# EAGLE design Dashboard Tester rev1 (EAGLE 9.6.2)
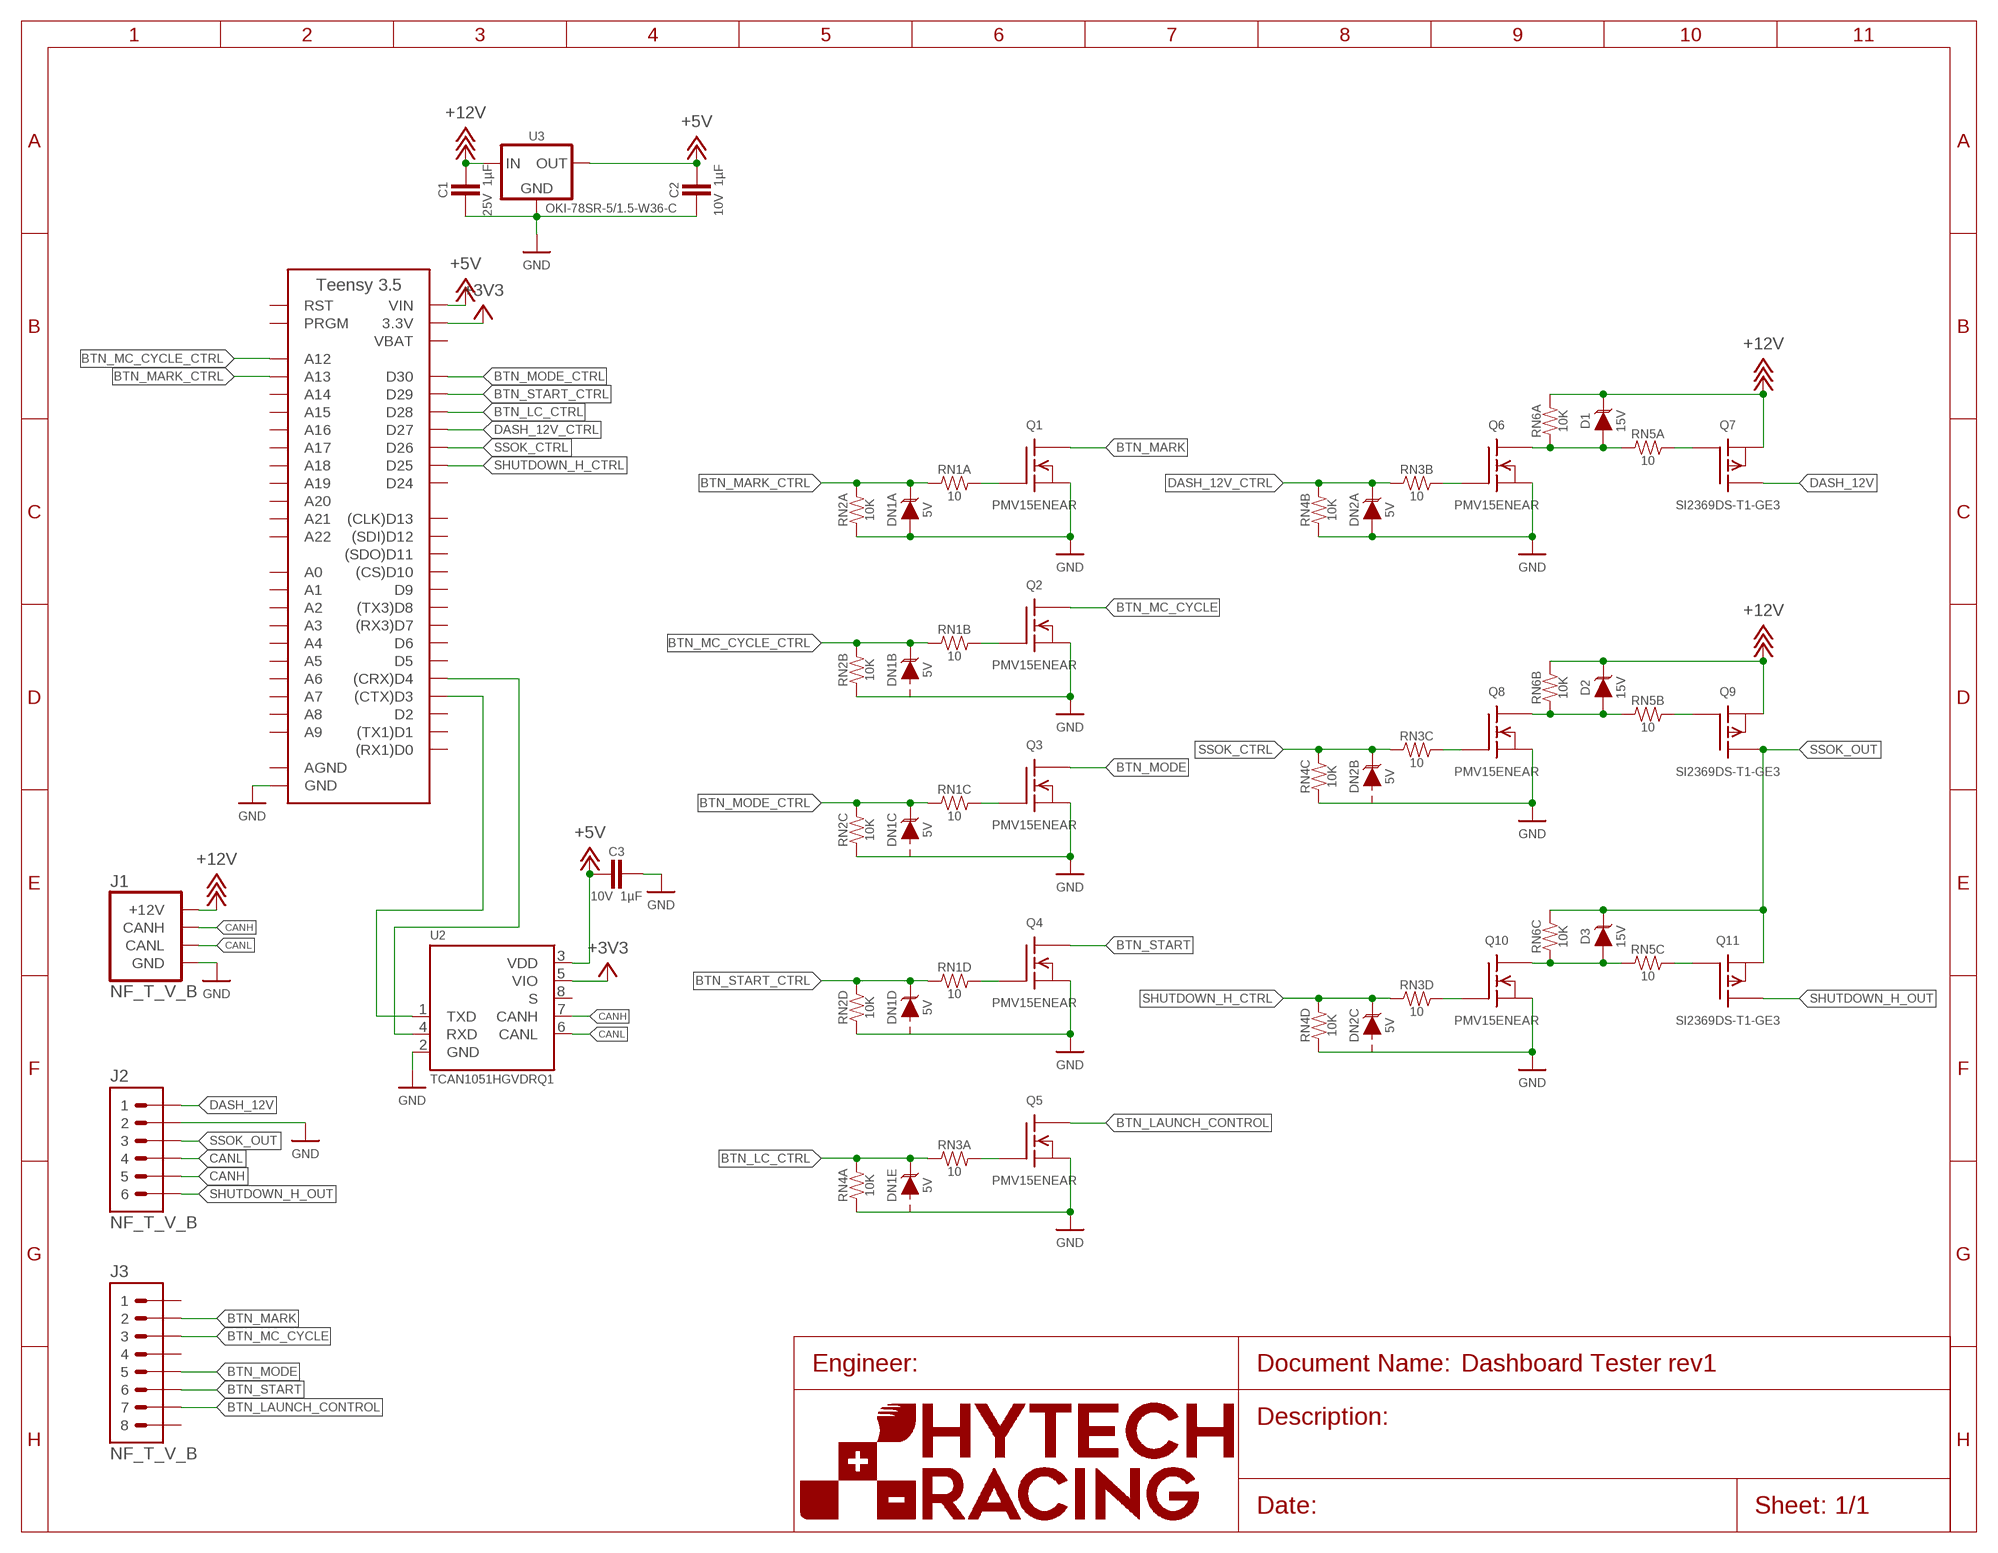
[diagram p0: schematic, sheet 1]
U$1 (FRAME_A): FRAME_DESCRIPTION: Default; ORIENTATION: LANDSCAPE; SIZE: A

## Parts
C1  CAPACITOR_0603_25V_1UF  [0603-CAP]
C2  CAPACITOR_0603_10V_1UF  [0603-CAP]
C3  CAPACITOR_0603_10V_1UF  [0603-CAP]
D1  TVS_15V  [SOT-23]
D2  TVS_15V  [SOT-23]
D3  TVS_15V  [SOT-23]
DN1  TVS_ARRAY_5V  [SOT363]
DN2  TVS_ARRAY_5V  [SOT363]
J1  CONNECTOR-CAN_NF_T_V_BLACK  [MOLEX_NANOFIT_PTH_04]
J2  CONNECTOR-6_NF_T_V_BLACK  [MOLEX_NANOFIT_PTH_06]
J3  CONNECTOR-8_NF_T_V_BLACK  [MOLEX_NANOFIT_PTH_08]
Q1  TRANSISTOR_N_MOS_PMV15ENEA  [SOT-23]
Q2  TRANSISTOR_N_MOS_PMV15ENEA  [SOT-23]
Q3  TRANSISTOR_N_MOS_PMV15ENEA  [SOT-23]
Q4  TRANSISTOR_N_MOS_PMV15ENEA  [SOT-23]
Q5  TRANSISTOR_N_MOS_PMV15ENEA  [SOT-23]
Q6  TRANSISTOR_N_MOS_PMV15ENEA  [SOT-23]
Q7  TRANSISTOR_P_MOS_SOT23_SI2369DS-T1-GE3  [SOT-23]
Q8  TRANSISTOR_N_MOS_PMV15ENEA  [SOT-23]
Q9  TRANSISTOR_P_MOS_SOT23_SI2369DS-T1-GE3  [SOT-23]
Q10  TRANSISTOR_N_MOS_PMV15ENEA  [SOT-23]
Q11  TRANSISTOR_P_MOS_SOT23_SI2369DS-T1-GE3  [SOT-23]
RN1  RESISTOR_NETWORK_4_10  [1206-RES]
RN2  RESISTOR_NETWORK_4_10K  [1206-RES]
RN3  RESISTOR_NETWORK_4_10  [1206-RES]
RN4  RESISTOR_NETWORK_4_10K  [1206-RES]
RN5  RESISTOR_NETWORK_4_10  [1206-RES]
RN6  RESISTOR_NETWORK_4_10K  [1206-RES]
U1  TEENSY_3.5  [TEENSY_LONG_EXT]
U2  CAN_TRANSCIEVER_TCAN1051HQV-Q1  [SOIC-08]
U3  VOLTAGE_REGULATOR_OKI-78SR_5V  [OKI-78SR]

## Nets
+3V3: U1.3V3(3.3V) U1.3V3@2(3.3V) U1.3V3@3(3.3V) U2.5(VIO)
+5V: C2.1 C3.2 U1.VIN U2.3(VDD) U3.3(OUT)
+12V: C1.1 D1.3(C) D2.3(C) J1.1(+12V) Q7.2(S) Q9.2(S) RN6.7 RN6.8 U3.1(IN)
BTN_LAUNCH_CONTROL: J3.7 Q5.3(D)
BTN_LC_CTRL: DN1.6(E:C) RN3.1 RN4.8 U1.D28
BTN_MARK: J3.2 Q1.3(D)
BTN_MARK_CTRL: DN1.1(A:C) RN1.1 RN2.8 U1.D32(A13)
BTN_MC_CYCLE: J3.3 Q2.3(D)
BTN_MC_CYCLE_CTRL: DN1.3(B:C) RN1.2 RN2.7 U1.D31(A12)
BTN_MODE: J3.5 Q3.3(D)
BTN_MODE_CTRL: DN1.4(C:C) RN1.3 RN2.6 U1.D30
BTN_START: J3.6 Q4.3(D)
BTN_START_CTRL: DN1.5(D:C) RN1.4 RN2.5 U1.D29
CANH: J1.4(CANH) J2.5 U2.7(CANH)
CANL: J1.3(CANL) J2.4 U2.6(CANL)
DASH_12V: J2.1 Q7.3(D)
DASH_12V_CTRL: DN2.1(A:C) RN3.2 RN4.7 U1.D27
GND: C1.2 C2.2 C3.1 DN1.2(A:A) DN2.2(A:A) J1.2(GND) J2.2 Q1.2(S) Q2.2(S) Q3.2(S) Q4.2(S) Q5.2(S) Q6.2(S) Q8.2(S) Q10.2(S) RN2.1 RN2.2 RN2.3 RN2.4 RN4.1 RN4.2 RN4.3 RN4.4 U1.GND U1.GND@2(GND) U1.GND@3(GND) U2.2(GND) U3.2(GND)
N$1: Q1.1(G) RN1.8
N$2: U1.D4((CRX)D4) U2.4(RXD)
N$3: Q6.1(G) RN3.7
N$4: Q2.1(G) RN1.7
N$6: Q3.1(G) RN1.6
N$8: Q4.1(G) RN1.5
N$10: Q5.1(G) RN3.8
N$13: Q8.1(G) RN3.6
N$15: Q9.1(G) RN5.7
N$16: D2.1(A) Q8.3(D) RN5.2 RN6.2
N$17: Q7.1(G) RN5.8
N$18: Q10.1(G) RN3.5
N$19: D1.1(A) Q6.3(D) RN5.1 RN6.1
N$20: U1.D3((CTX)D3) U2.1(TXD)
N$21: Q11.1(G) RN5.6
N$22: D3.1(A) Q10.3(D) RN5.3 RN6.3
SHUTDOWN_H_CTRL: DN2.4(C:C) RN3.4 RN4.5 U1.D25
SHUTDOWN_H_OUT: J2.6 Q11.3(D)
SSOK_CTRL: DN2.3(B:C) RN3.3 RN4.6 U1.D26
SSOK_OUT: D3.3(C) J2.3 Q9.3(D) Q11.2(S) RN6.6
Unconnected: DN2.5(D:C) DN2.6(E:C) J3.1 J3.4 J3.8 RN5.4 RN5.5 RN6.4 RN6.5 U1.D0((RX1)D0) U1.D1((TX1)D1) U1.D2 U1.D5 U1.D6 U1.D7((RX3)D7) U1.D8((TX3)D8) U1.D9 U1.D10((CS)D10) U1.D11((SDO)D11) U1.D12((SDI)D12) U1.D13((CLK)D13) U1.D14(A0) U1.D15(A1) U1.D16(A2) U1.D17(A3) U1.D18(A4) U1.D19(A5) U1.D20(A6) U1.D21(A7) U1.D22(A8) U1.D23(A9) U1.D24 U1.D33(A14) U1.D34(A15) U1.D35(A16) U1.D36(A17) U1.D37(A18) U1.D38(A19) U1.D39(A20) U1.D40(A21) U1.D41(A22) U1.ON/OFF(RST) U1.PRGM U2.8(S)

## Power pins joined to a net without a drawn wire
AGND: U1.AGND/GND(AGND)
VBAT: U1.VBAT

## Library data of the parts
C1 = HyTechDevices:CAPACITOR_?_*: Capacitor, Non-Polarized VJ...1BC Series Datasheet <https://www.mouser.com/datasheet/2/427/vjw1bcbascomseries-1762447.pdf> Samsung Datasheet <https://www.mouser.com/datasheet/2/585/MLCC-1837944.pdf> Walsin Datasheet <https://www.mouser.com/datasheet/2/210/WTC_MLCC_General_Purpose-1534899.pdf>; CAPACITANCE: 1µF; DKPN: 1276-1184-1-ND; MANUFACTURER: Samsung Electro-Mechanics; MOPN: 187-CL10B105KA8NNNC; MPN: CL10B105KA8NNNC; TOLERANCE: 10%; VOLTAGE: 25V
C2 C3 = HyTechDevices:CAPACITOR_?_*: Capacitor, Non-Polarized VJ...1BC Series Datasheet <https://www.mouser.com/datasheet/2/427/vjw1bcbascomseries-1762447.pdf> Samsung Datasheet <https://www.mouser.com/datasheet/2/585/MLCC-1837944.pdf> Walsin Datasheet <https://www.mouser.com/datasheet/2/210/WTC_MLCC_General_Purpose-1534899.pdf>; CAPACITANCE: 1µF; DKPN: 311-1796-1-ND; MANUFACTURER: Yageo; MOPN: 603-CC603KRX7R6BB105; MPN: CC0603KRX7R6BB105; TOLERANCE: 10%; VOLTAGE: 10V
D1-D3 = HyTechDevices:TVS_*: TVS Diode GSOT Datasheet <https://www.mouser.com/datasheet/2/427/gsot03-1767593.pdf>; DKPN: GSOT15-E3-08CT-ND; MANUFACTURER: Vishay General Semiconductor - Diodes Division; MOPN: 78-GSOT15-E3-08; MPN: GSOT15-E3-08; VOLTAGE: 15V
DN1 DN2 = HyTechDevices:TVS_ARRAY_*: TVS Diode Array Datasheet <https://www.mouser.com/datasheet/2/427/vesd05a5-06gtovesd26a5-06g-1768003.pdf>; DKPN: 112-VESD05A5-06G-G3-08CT-ND; MANUFACTURER: Vishay General Semiconductor - Diodes Division; MOPN: 78-VESD05A5-06G-G308; MPN: VESD05A5-06G-G3-08; VOLTAGE: 5V
J1 = HyTechDevices:CONNECTOR-CAN_?_*: HyTech CAN Connector; MANUFACTURER: Molex; MODEL: NF_T_V_B; MPN: 105429-1304
J2 = HyTechDevices:CONNECTOR-6_?_*: 6 Pin Connector; MANUFACTURER: Molex; MODEL: NF_T_V_B; MPN: 105310-1306
J3 = HyTechDevices:CONNECTOR-8_?_*: 8 Pin Connector; MANUFACTURER: Molex; MODEL: NF_T_V_B; MPN: 105310-1308
Q1-Q6 Q8 Q10 = HyTechDevices:TRANSISTOR_N_MOS_*: N-MOSFET PMV15ENEA Datasheet <https://www.mouser.com/datasheet/2/916/PMV15ENEA-1604828.pdf>; DKPN: 1727-8588-1-ND; MANUFACTURER: Nexperia USA Inc.; MOPN: 771-PMV15ENEAR; MPN: PMV15ENEAR
Q7 Q9 Q11 = HyTechDevices:TRANSISTOR_P_MOS_?_*: MOSFET P Channel Datasheet <https://www.mouser.com/datasheet/2/427/si2369d-1764360.pdf>; DKPN: SI2369DS-T1-GE3CT-ND; MANUFACTURER: Vishay Siliconix; MOPN: 78-SI2369DS-T1-GE3; MPN: SI2369DS-T1-GE3
RN1 RN3 RN5 = HyTechDevices:RESISTOR_NETWORK_4_*: Resistor Network, 4 Elements YC/TC Series <https://www.mouser.com/datasheet/2/447/yageo_yago_s_a0009164376_1-1991537.pdf> CAT/CAY 16 Series <https://www.mouser.com/datasheet/2/54/CATCAY-777361.pdf>; DKPN: CAT16-100J4LFCT-ND; MANUFACTURER: Bourns Inc.; MOPN: 652-CAT16-100J4LF; MPN: CAT16-100J4LF; RESISTANCE: 10
RN2 RN4 RN6 = HyTechDevices:RESISTOR_NETWORK_4_*: Resistor Network, 4 Elements YC/TC Series <https://www.mouser.com/datasheet/2/447/yageo_yago_s_a0009164376_1-1991537.pdf> CAT/CAY 16 Series <https://www.mouser.com/datasheet/2/54/CATCAY-777361.pdf>; DKPN: YAG3410CT-ND; MANUFACTURER: Yageo; MOPN: 603-TC164-FR-0710KL; MPN: TC164-FR-0710KL; RESISTANCE: 10K
U1 = HyTechDevices:TEENSY_3.5; TEENSY: 3.5
U2 = HyTechDevices:CAN_TRANSCIEVER_TCAN1051*V-Q1: TCAN1051*V Can Tranciever Datasheet <https://www.ti.com/lit/ds/symlink/tcan1051hgv-q1.pdf?HQS=dis-mous-null-mousermode-dsf-pf-null-wwe&ts=1610765132518&ref_url=https%253A%252F%252Fwww.mouser.com%252Ff>; DKPN: 296-49935-1-ND; MANUFACTURER: Texas Instruments; MOPN: 595-TCAN1051HGVDQ1; MPN: TCAN1051HGVDRQ1
U3 = HyTechDevices:VOLTAGE_REGULATOR_?_*: Voltage Regulators LDL1117S50R Datasheet <https://www.mouser.com/datasheet/2/389/dm00366442-1799212.pdf> OKI-78SR Datasheet <https://www.mouser.com/datasheet/2/281/oki-78sr-56393.pdf>; DKPN: 811-2196-5-ND; MANUFACTURER: Murata Power Solutions Inc.; MOPN: 580-OKI78SR5/1.5W36C; MPN: OKI-78SR-5/1.5-W36-C

## Board
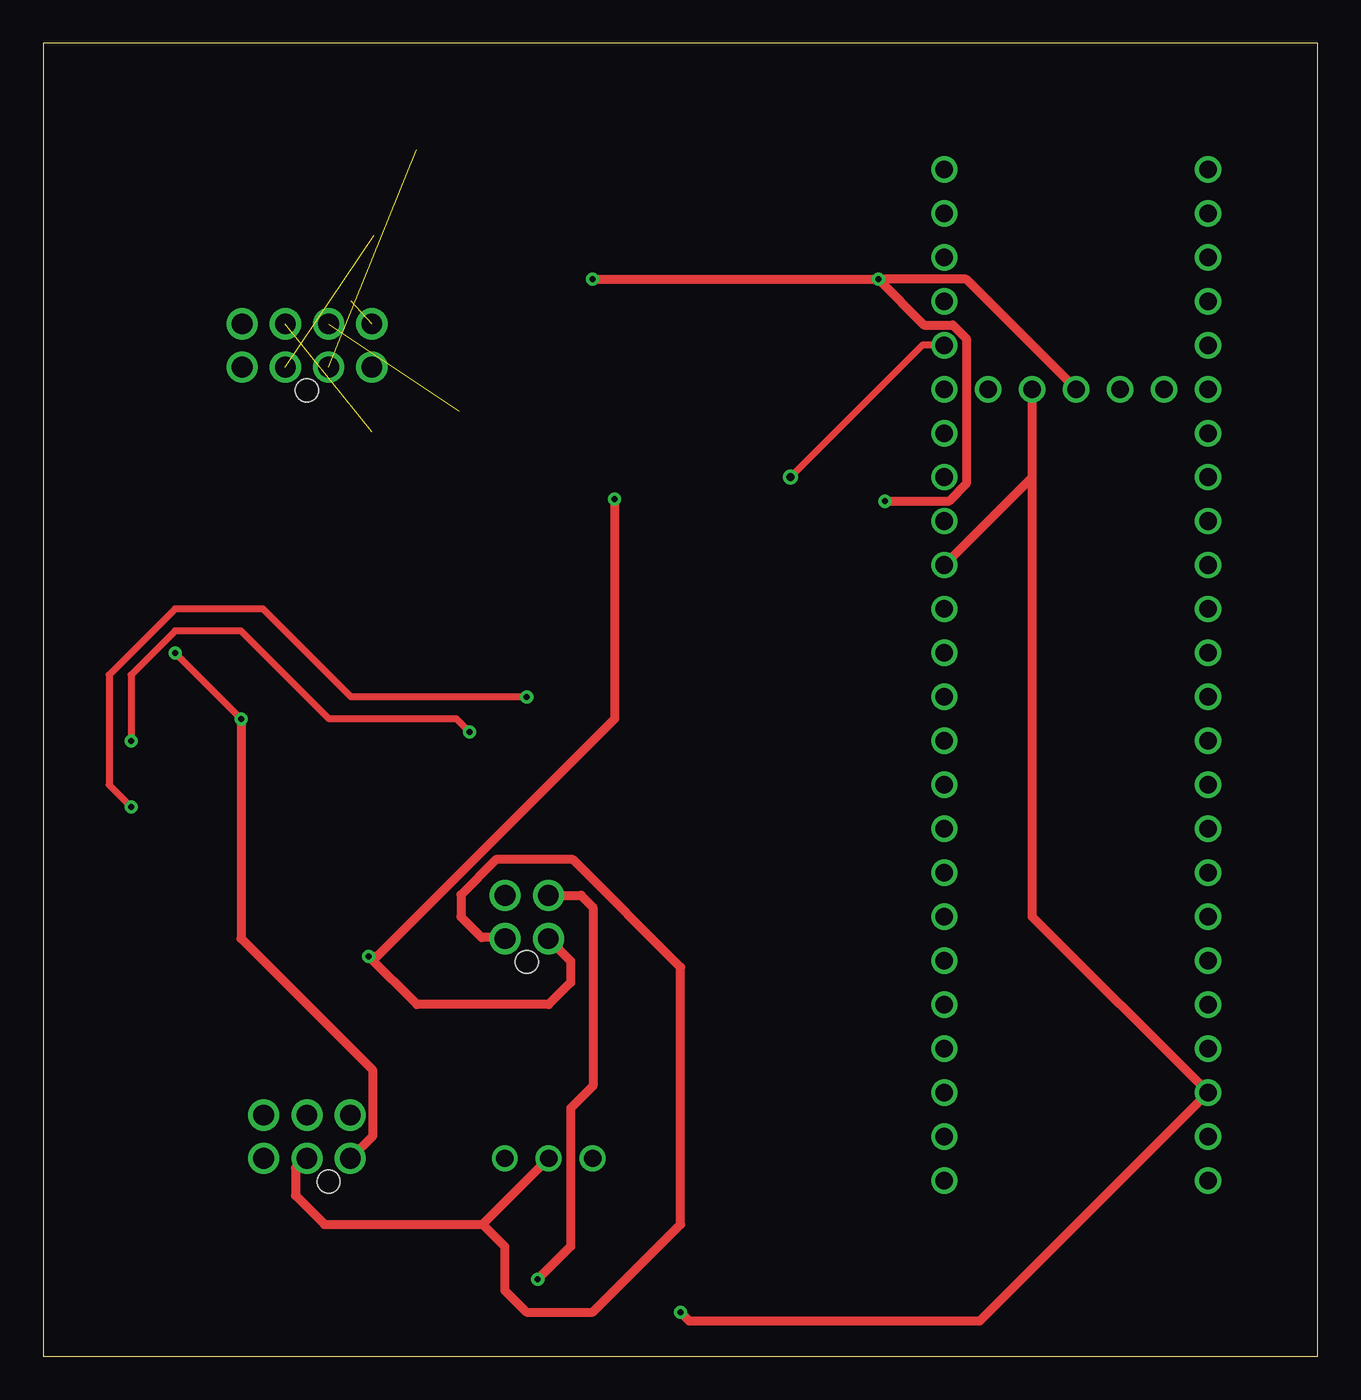
[diagram p1: board, top side]
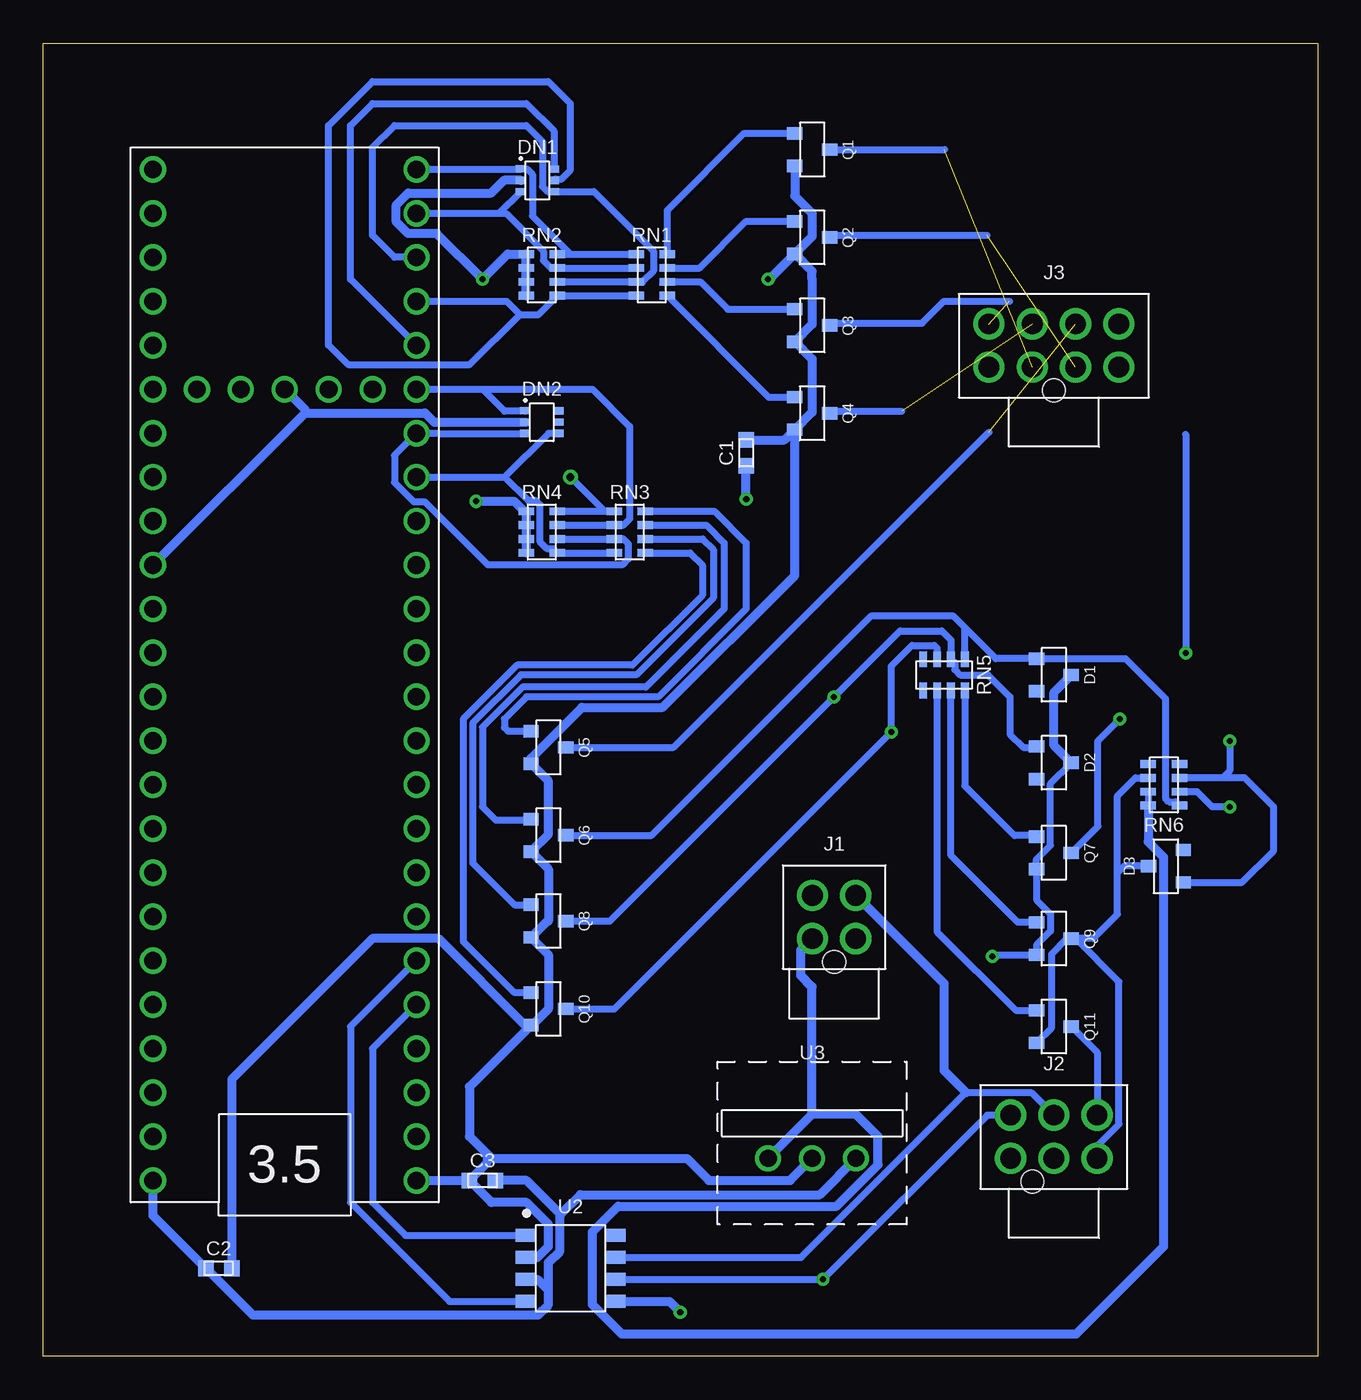
[diagram p2: board, bottom side, seen from below]

Size 73.64 x 75.87 mm. Coordinates in mm from the lower left corner, seen from the top.
Outline: 0,0 73.64,0 73.64,75.87 0,75.87 0,0
Copper layers (1*16): Top 0.035mm / dielectric 1.5mm / Bottom 0.035mm
Design rules "default": minimum track width 6mil, minimum drill 0.35mm, track to track 6mil, track to pad 6mil, pad to pad 6mil, via to via 6mil, smd to smd 6mil, copper to edge 40mil, drill to drill 6mil, minimum pad ring 10mil, minimum via ring 8mil, stop-mask expansion 4mil, vias tented up to drill 0mil, thermal gap 10mil

### Footprints (pad centres in the part's own frame; a part is rotated, then mirrored left to right if it is on the bottom)
0603-CAP = smd 0.9 x 0.9: 1 -0.75,0; 2 0.75,0
SOT-23 = smd 0.711 x 0.889: 1 -0.94,-1.003; 2 0.94,-1.003; 3 0,1.003
SOT363 = smd 0.42 x 0.6: 1 -0.673,-0.95; 2 0,-0.95; 3 0.65,-0.95; 4 0.65,0.95; 5 0,0.95; 6 -0.65,0.95
MOLEX_NANOFIT_PTH_04 = drill 1.2: 1 1.25,0; 2 -1.25,0; 3 1.25,-2.5; 4 -1.25,-2.5 | hole 1.3: 0,1.34
MOLEX_NANOFIT_PTH_06 = drill 1.2: 1 2.5,0; 2 0,0; 3 -2.5,0; 4 2.5,-2.5; 5 0,-2.5; 6 -2.5,-2.5 | hole 1.3: 1.25,1.34
MOLEX_NANOFIT_PTH_08 = drill 1.2: 1 3.75,0; 2 1.25,0; 3 -1.25,0; 4 -3.75,0; 5 3.75,-2.5; 6 1.25,-2.5; 7 -1.25,-2.5; 8 -3.75,-2.5 | hole 1.3: 0,1.34
1206-RES = smd 0.45 x 0.9: 1 -1.2,-0.9; 2 -0.4,-0.9; 3 0.4,-0.9; 4 1.2,-0.9; 5 1.2,0.9; 6 0.4,0.9; 7 -0.4,0.9; 8 -1.2,0.9
TEENSY_LONG_EXT = drill 1.016: 3V3 0,5.08; 3V3@2 15.24,35.56; 3V3@3 10.16,45.72; AGND/GND 0,2.54; D0 15.24,2.54; D1 15.24,5.08; D2 15.24,7.62; D3 15.24,10.16; D4 15.24,12.7; D5 15.24,15.24; D6 15.24,17.78; D7 15.24,20.32; D8 15.24,22.86; D9 15.24,25.4; D10 15.24,27.94; D11 15.24,30.48; D12 15.24,33.02; D13 0,33.02; D14 0,30.48; D15 0,27.94; D16 0,25.4; D17 0,22.86; D18 0,20.32; D19 0,17.78; D20 0,15.24; D21 0,12.7; D22 0,10.16; D23 0,7.62; D24 15.24,38.1; D25 15.24,40.64; D26 15.24,43.18; D27 15.24,45.72; D28 15.24,48.26; D29 15.24,50.8; D30 15.24,53.34; D31 15.24,55.88; D32 15.24,58.42; D33 0,58.42; D34 0,55.88; D35 0,53.34; D36 0,50.8; D37 0,48.26; D38 0,45.72; D39 0,43.18; D40 0,40.64; D41 0,38.1; GND 15.24,0; GND@2 0,35.56; GND@3 7.62,45.72; ON/OFF 2.54,45.72; PRGM 5.08,45.72; VBAT 12.7,45.72; VIN 0,0
SOIC-08 = smd 0.762 x 1.143: 1 -1.905,-2.603; 2 -0.635,-2.603; 3 0.635,-2.603; 4 1.905,-2.603; 5 1.905,2.603; 6 0.635,2.603; 7 -0.635,2.603; 8 -1.905,2.603
OKI-78SR = drill 0.991: 1 -2.54,0; 2 0,0; 3 2.54,0

### Placement (x,y rotation side)
C1  33.02,52.2 90 bottom
C2  63.5,5.08 0 bottom
C3  48.26,10.16 0 bottom
D1  15.24,39.37 270 bottom
D2  15.24,34.29 270 bottom
D3  8.76,28.32 90 bottom
DN1  45.09,67.94 270 bottom
DN2  44.83,53.98 270 bottom
J1  27.94,24.13 180 bottom
J2  15.24,11.43 180 bottom
J3  15.24,57.15 180 bottom
Q1  29.21,69.72 270 bottom
Q2  29.21,64.64 270 bottom
Q3  29.21,59.56 270 bottom
Q4  29.21,54.48 270 bottom
Q5  44.45,35.18 270 bottom
Q6  44.45,30.1 270 bottom
Q7  15.24,29.08 270 bottom
Q8  44.45,25.15 270 bottom
Q9  15.24,24.13 270 bottom
Q10  44.45,20.07 270 bottom
Q11  15.24,19.05 270 bottom
RN1  38.48,62.48 270 bottom
RN2  44.83,62.48 270 bottom
RN3  39.75,47.62 270 bottom
RN4  44.83,47.62 270 bottom
RN5  21.59,39.37 180 bottom
RN6  8.89,33.02 90 bottom
U1  67.31,10.16 0 bottom
U2  43.18,5.08 270 bottom
U3  29.21,11.43 0 bottom

### Tracks (layer width: path | path; a pad name or v marks a point on that pad's centre or on a via)
+3V3  (via drill 0.35 pad 0.55)
  Top 0.508: U1.3V3@2 57.15,50.8 | 57.15,50.8 U1.3V3@3 | 57.15,50.8 57.15,25.4 U1.3V3 54.1,2.03 37.34,2.03 v36.83,2.54
  Bottom 0.508: U2.5 37.47,3.17 v36.83,2.54
+5V
  Bottom 0.508: U1.VIN 67.31,8.14 C2.1 64.22,5.08 61.53,2.39 45.04,2.39 44.45,2.98 44.45,3.81 | C3.2 45.72,10.16 43.75,8.19 | U3.3 28.77,9.34 42.6,9.34 43.75,8.19 | 44.45,3.81 45.09,4.45 U2.3 | 44.45,3.81 44.45,5.42 43.79,6.08 43.79,8.15 43.75,8.19
+12V  (via drill 0.35 pad 0.55)
  Top 0.508: v33.02,49.53 33.02,36.83 19.3,23.11 v18.8,23.11 21.59,20.32 29.21,20.32 30.48,21.59 30.48,22.84 J1.1
  Bottom 0.406: D2.3 15.44,33.08 15.44,29.52 16.24,28.72 Q7.2 16.24,26.37 15.44,25.57 15.44,24.57 16.24,23.77 Q9.2 18.72,23.19 v18.8,23.11 | RN6.7 RN6.8
  Bottom 0.508: v33.02,49.53 C1.1 | RN6.8 9.79,29.72 8.91,28.84 8.91,6.38 8.89,6.35 13.97,1.27 40.2,1.27 41.91,2.98 41.91,7.18 40.41,8.67 27.79,8.67 25.4,11.07 25.4,12.7 26.67,13.97 29.21,13.97 | U3.1 29.21,13.97 | 29.21,13.97 29.21,21.34 29.86,22 29.86,23.46 J1.1 | D2.3 15.24,35.29 15.24,38.37 D1.3
BTN_LAUNCH_CONTROL  (1 unrouted)
  Bottom 0.406: Q5.3 37.21,35.18 18.99,53.4
BTN_LC_CTRL  (via drill 0.45)
  Top 0.406: v43.18,50.8 50.8,58.42 U1.D28
  Bottom 0.406: U1.D28 55.88,62.23 55.88,71.12 54.61,72.39 45.72,72.39 44.13,70.81 DN1.6 | RN4.8 41.2,48.83 | 41.2,48.83 RN3.1 | v43.18,50.8 41.2,48.83
BTN_MARK  (1 unrouted)
  Bottom 0.406: Q1.3 21.56,69.72
BTN_MARK_CTRL
  Bottom 0.406: U1.D32 46.07,68.58 DN1.1 45.7,68.62 45.38,68.3 45.38,65.88 43.18,63.68 | RN2.8 43.18,63.68 | 43.18,63.68 RN1.1
BTN_MC_CYCLE  (1 unrouted)
  Bottom 0.406: Q2.3 28.08,64.77 19.11,64.77
BTN_MC_CYCLE_CTRL
  Bottom 0.406: RN1.2 RN2.7 44.31,62.88 44.74,63.31 44.74,63.87 46.91,66.04 47.29,66.04 | U1.D31 47.29,66.04 | 47.29,66.04 DN1.3
BTN_MODE  (1 unrouted)
  Bottom 0.406: Q3.3 28.08,59.69 22.86,59.69 21.59,60.96 17.8,60.96
BTN_MODE_CTRL
  Bottom 0.406: RN2.6 RN1.3 39,62.08 38.39,62.7 38.39,63.87 41.81,67.3 DN1.4 44.5,67.3 44.79,67.59 44.79,70.19 45.72,71.12 53.34,71.12 54.61,69.85 54.61,64.77 53.34,63.5 U1.D30
BTN_START  (1 unrouted)
  Bottom 0.406: Q4.3 28.08,54.61 24.03,54.61
BTN_START_CTRL
  Bottom 0.406: RN1.4 RN2.5 45.02,60.2 46.1,60.2 | 46.1,60.2 46.86,60.96 U1.D29 | DN1.5 44.05,68.03 43.69,68.03 43.18,68.54 43.18,72.39 44.45,73.66 54.61,73.66 57.15,71.12 57.15,58.42 56.03,57.3 49,57.3 46.1,60.2
CANH
  Bottom 0.406: U2.7 29.84,5.71 20.32,15.24 16.55,15.24 J2.5
  Bottom 0.508: J1.4 21.59,21.53 21.59,16.51 20.32,15.24
CANL  (via drill 0.35)
  Top 0.508: J1.3 31.08,26.63 31.77,25.94 31.77,15.62 30.48,14.33 30.48,6.35 v28.57,4.45
  Bottom 0.406: U2.6 v28.57,4.45 19.09,13.93 J2.4
DASH_12V  (via drill 0.35)
  Top 0.406: v11.43,36.83 v7.62,40.64
  Top 0.508: v11.43,36.83 11.43,24.13 19.05,16.51 19.05,12.74 J2.1
  Bottom 0.406: Q7.3 12.7,30.62 12.7,35.56 v11.43,36.83 | 7.62,53.28 v7.62,40.64
DASH_12V_CTRL
  Bottom 0.406: RN4.7 RN3.2 40.11,48.02 39.75,48.39 39.75,53.72 41.91,55.88 48.26,55.88 | U1.D27 48.26,55.88 | DN2.1 45.82,54.61 46.99,54.61 48.26,55.88
GND  (via drill 0.35)
  Top 0.508: v31.75,62.23 v48.26,62.23 | v48.26,62.23 50.9,59.59 52.55,59.59 53.34,58.8 53.34,50.42 52.35,49.43 48.64,49.43 v48.64,49.4 | U3.2 25.4,7.62 | 25.4,7.62 16.25,7.62 14.57,9.29 14.57,10.88 15.12,11.43 J2.2 | 25.4,7.62 26.67,6.35 26.67,3.81 27.94,2.54 31.75,2.54 36.83,7.62 36.83,22.48 30.61,28.7 26.16,28.7 24.13,26.67 24.13,25.4 25.34,24.19 26.63,24.19 J1.2 | U1.GND@3 53.34,62.23 v48.26,62.23
  Bottom 0.406: 44.45,25.15 45.39,24.21 Q8.2 | 45.39,19.13 Q10.2
  Bottom 0.508: Q1.2 30.21,67.04 29.21,66.04 29.21,64.71 Q2.2 | Q4.2 29.21,54.55 29.21,57.62 Q3.2 29.21,59.63 29.21,62.23 29.21,62.7 Q2.2 | RN4.4 RN4.3 RN4.2 RN4.1 45.86,48.83 46.44,49.4 v48.64,49.4 | RN2.4 RN2.3 RN2.2 RN2.1 46.81,63.68 v48.26,62.23 50.9,64.87 52.55,64.87 53.24,65.56 53.24,66.52 52.55,67.21 47.75,67.21 47.02,67.94 DN1.2 | 45.39,19.13 44.45,20.07 44.45,23.2 Q8.2 44.51,25.15 44.45,25.15 44.45,28.16 Q6.2 44.45,30.16 44.45,33.24 Q5.2 45.45,34.55 42.51,37.49 37.85,37.49 30.21,45.12 Q4.2 | U1.GND@2 58.52,54.51 | 58.52,54.51 51.59,54.51 51.05,53.98 DN2.2 | 58.52,54.51 58.52,54.71 U1.GND@3 | U2.2 45.09,5.71 44.45,6.35 44.45,7.62 45.72,8.89 47.74,8.89 C3.1 | C2.2 62.75,15.99 54.61,24.13 50.8,24.13 45.8,19.13 Q10.2 49.01,15.57 49.01,12.7 48,11.69 | U3.2 30.48,10.16 35.18,10.16 36.45,11.43 47.74,11.43 48,11.69 | U1.GND C3.1 | 48,11.69 48,11.17 C3.1 | C1.2 30.81,52.95 Q4.2 | v31.75,62.23 31.69,62.23 Q2.2
N$1
  Bottom 0.406: RN1.8 37.58,66.22 33.14,70.66 Q1.1
N$2
  Bottom 0.406: U1.D4 55.88,19.05 55.88,8.89 50.16,3.17 U2.4
N$3
  Bottom 0.406: Q6.1 45.5,30.99 47.5,30.99 48.26,31.75 48.26,36.35 45.95,38.66 38.81,38.66 34.29,43.18 34.29,46.99 35.33,48.02 RN3.7
N$4
  Bottom 0.406: RN1.7 35.72,62.88 33.02,65.58 Q2.1
N$6
  Bottom 0.406: RN1.6 35.67,62.08 34.09,60.5 Q3.1
N$8
  Bottom 0.406: RN1.5 31.72,55.42 Q4.1
N$10
  Bottom 0.406: RN3.8 34.85,48.83 33.02,46.99 33.02,43.18 38.1,38.1 45.72,38.1 46.99,36.83 46.99,36.32 46.79,36.12 Q5.1
N$13
  Bottom 0.406: RN3.6 35.54,47.23 34.92,46.61 34.92,43.81 39.37,39.37 46.03,39.37 48.82,36.58 48.82,28.5 46.41,26.09 Q8.1
N$15
  Bottom 0.406: Q9.1 17.32,25.07 21.19,28.94 RN5.7
N$16  (via drill 0.35 pad 0.55)
  Top 0.406: v27.94,38.1 17.78,38.1 12.7,43.18 7.62,43.18 3.81,39.37 3.81,33.02 v5.08,31.75
  Bottom 0.406: D2.1 16.29,35.18 17.02,35.18 17.78,35.94 17.78,38.1 19.05,39.37 20.67,39.37 20.97,39.67 20.97,40.05 RN5.2 21.19,41.38 21.72,41.91 24.13,41.91 v27.94,38.1 40.89,25.15 Q8.3 | v5.08,31.75 6.1,31.75 6.97,32.62 RN6.2
N$17
  Bottom 0.406: RN5.8 20.39,32.96 17.51,30.09 16.31,30.09 Q7.1
N$18
  Bottom 0.406: RN3.5 36.27,46.42 35.56,45.72 35.56,43.97 39.6,39.93 46.26,39.93 49.38,36.81 49.38,23.98 46.41,21.01 Q10.1
N$19
  Bottom 0.406: RN5.1 20.39,42.11 | 20.39,42.11 21.08,42.8 25.78,42.8 38.48,30.1 Q6.3 | 20.39,42.11 18.59,40.31 D1.1 11.1,40.31 8.8,38.01 8.8,32.25 8.59,32.04 8.21,32.04 RN6.1
N$20
  Bottom 0.406: U1.D3 54.61,17.78 54.61,8.89 52.7,6.99 U2.1
N$21
  Bottom 0.406: RN5.6 21.99,24.53 17.45,19.99 Q11.1
N$22  (via drill 0.35 pad 0.55)
  Top 0.406: v24.64,36.07 23.88,36.83 16.51,36.83 11.43,41.91 7.62,41.91 5.08,39.37 v5.08,35.56
  Bottom 0.406: RN5.3 21.99,40.91 22.15,41.08 23.44,41.08 24.64,39.88 v24.64,36.07 40.64,20.07 Q10.3 | 5.48,33.42 RN6.3 | v5.08,35.56 5.08,33.82 5.48,33.42 | D3.1 4.37,27.38 2.54,29.21 2.54,31.75 4.21,33.42 5.48,33.42
SHUTDOWN_H_CTRL
  Bottom 0.406: RN3.4 RN4.5 44.15,46.64 44.53,46.64 44.92,47.04 44.92,49.2 45.16,49.44 45.61,49.44 46.98,50.8 | U1.D25 46.98,50.8 | 46.98,50.8 44.45,53.33 44.45,53.34 43.9,53.34 DN2.4
SHUTDOWN_H_OUT
  Bottom 0.406: Q11.3 12.74,17.55 J2.6
SSOK_CTRL
  Bottom 0.406: DN2.3 50.81,53.33 50.83,53.34 U1.D26 53.34,52.07 53.34,50.49 52.23,49.38 51.61,49.38 47.95,45.72 40.18,45.72 39.84,46.05 39.84,46.96 40.11,47.23 RN3.3 RN4.6
SSOK_OUT
  Bottom 0.406: Q11.2 15.37,18.99 15.37,23.24 14.48,24.13 Q9.3 14.1,24.26 13.97,24.13 | RN6.6 10.52,33.42 11.56,32.38 11.56,27.94 | J2.3 12.74,12.15 11.48,13.41 11.48,21.64 13.97,24.13 | 13.97,24.13 12.97,24.13 11.56,25.53 11.56,27.94 | 11.56,27.94 11.18,28.32 D3.3